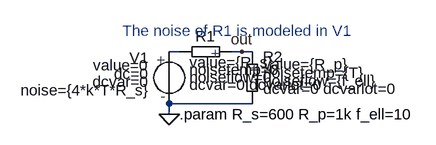
[diagram p0: schematic ExNoiseFigureRp.asc]
ExNoiseFigureRp.asc, the LTspice schematic file:
Version 4
SHEET 1 880 680
WIRE 128 0 112 0
WIRE 224 0 208 0
WIRE 240 0 224 0
WIRE 240 80 112 80
WIRE 112 96 112 80
FLAG 112 96 0
FLAG 224 0 out
SYMBOL SLV 112 0 M0
WINDOW 40 30 59 Left 2
WINDOW 3 32 21 Left 2
WINDOW 123 32 34 Left 2
WINDOW 39 31 46 Left 2
SYMATTR SpiceLine2 noise={4*k*T*R_s}
SYMATTR InstName V1
SYMBOL SLR 208 0 R90
WINDOW 0 -8 40 VBottom 2
WINDOW 3 16 65 VLeft 2
WINDOW 123 28 65 VLeft 2
WINDOW 39 39 65 VLeft 2
WINDOW 40 51 65 VLeft 2
SYMATTR InstName R1
SYMATTR Value value={R_s}
SYMBOL SLR 240 0 R0
WINDOW 3 17 19 Left 2
WINDOW 123 17 32 Left 2
WINDOW 39 17 45 Left 2
WINDOW 40 17 57 Left 2
SYMATTR Value value={R_p}
SYMATTR Value2 noisetemp={T}
SYMATTR SpiceLine noiseflow={f_ell}
SYMATTR InstName R2
TEXT 128 96 Left 2 !.param R_s=600 R_p=1k f_ell=10
TEXT 40 -32 Left 2 ;The noise of R1 is modeled in V1

The netlist it stands for:
* ExNoiseFigureRp.asc
V1 N001 0 V value=0 dc=0 dcvar=0 noise={4*k*T*R_s}
R1 out N001 R value={R_s} noisetemp=0 noiseflow=0 dcvar=0 dcvarlot=0
R2 out 0 R value={R_p} noisetemp={T} noiseflow={f_ell} dcvar=0 dcvarlot=0
.param R_s=600 R_p=1k f_ell=10
* The noise of R1 is modeled in V1
.backanno
.end